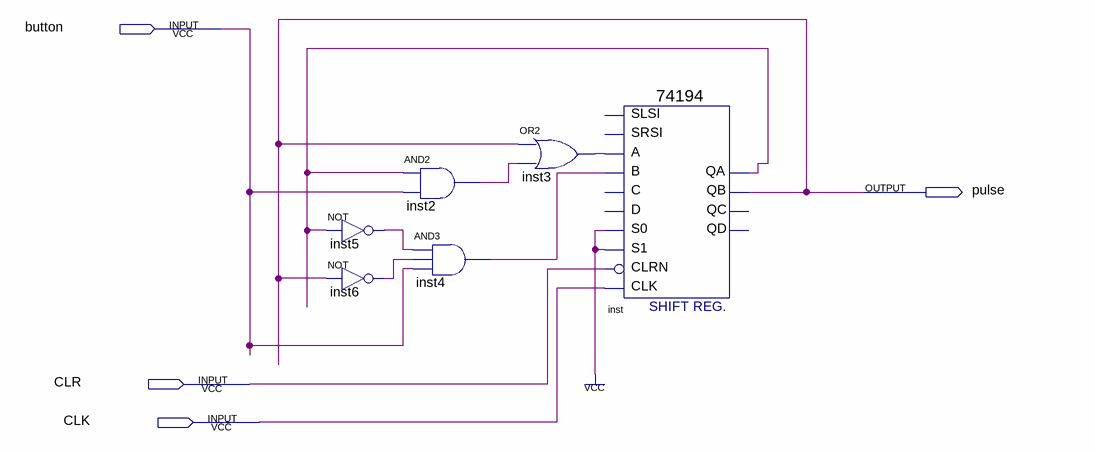
[diagram p0: schematic sheet]
// Quartus schematic edgepulse.bdf as structural Verilog: 6 symbols, 4 pins
module edgepulse (
  input  button,
  input  CLR,
  input  CLK,
  output pulse
);

  wire inst2_out, inst3_out, inst4_out, inst5_out, inst6_out, inst_qa;

  not inst5 (inst5_out, inst_qa);
  not inst6 (inst6_out, pulse);
  and inst2 (inst2_out, inst_qa, button);
  and inst4 (inst4_out, inst5_out, inst6_out, button);
  or inst3 (inst3_out, pulse, inst2_out);
  \74194  inst (
    .B(inst4_out), .CLK(CLK), .CLRN(CLR), .S1(1'b1), .S0(1'b1), .A(inst3_out), .QA(inst_qa), .QB(pulse));  // open: SLSI, SRSI, C, D, QC, QD
endmodule
